# EAGLE design cube (EAGLE 9.5.2)
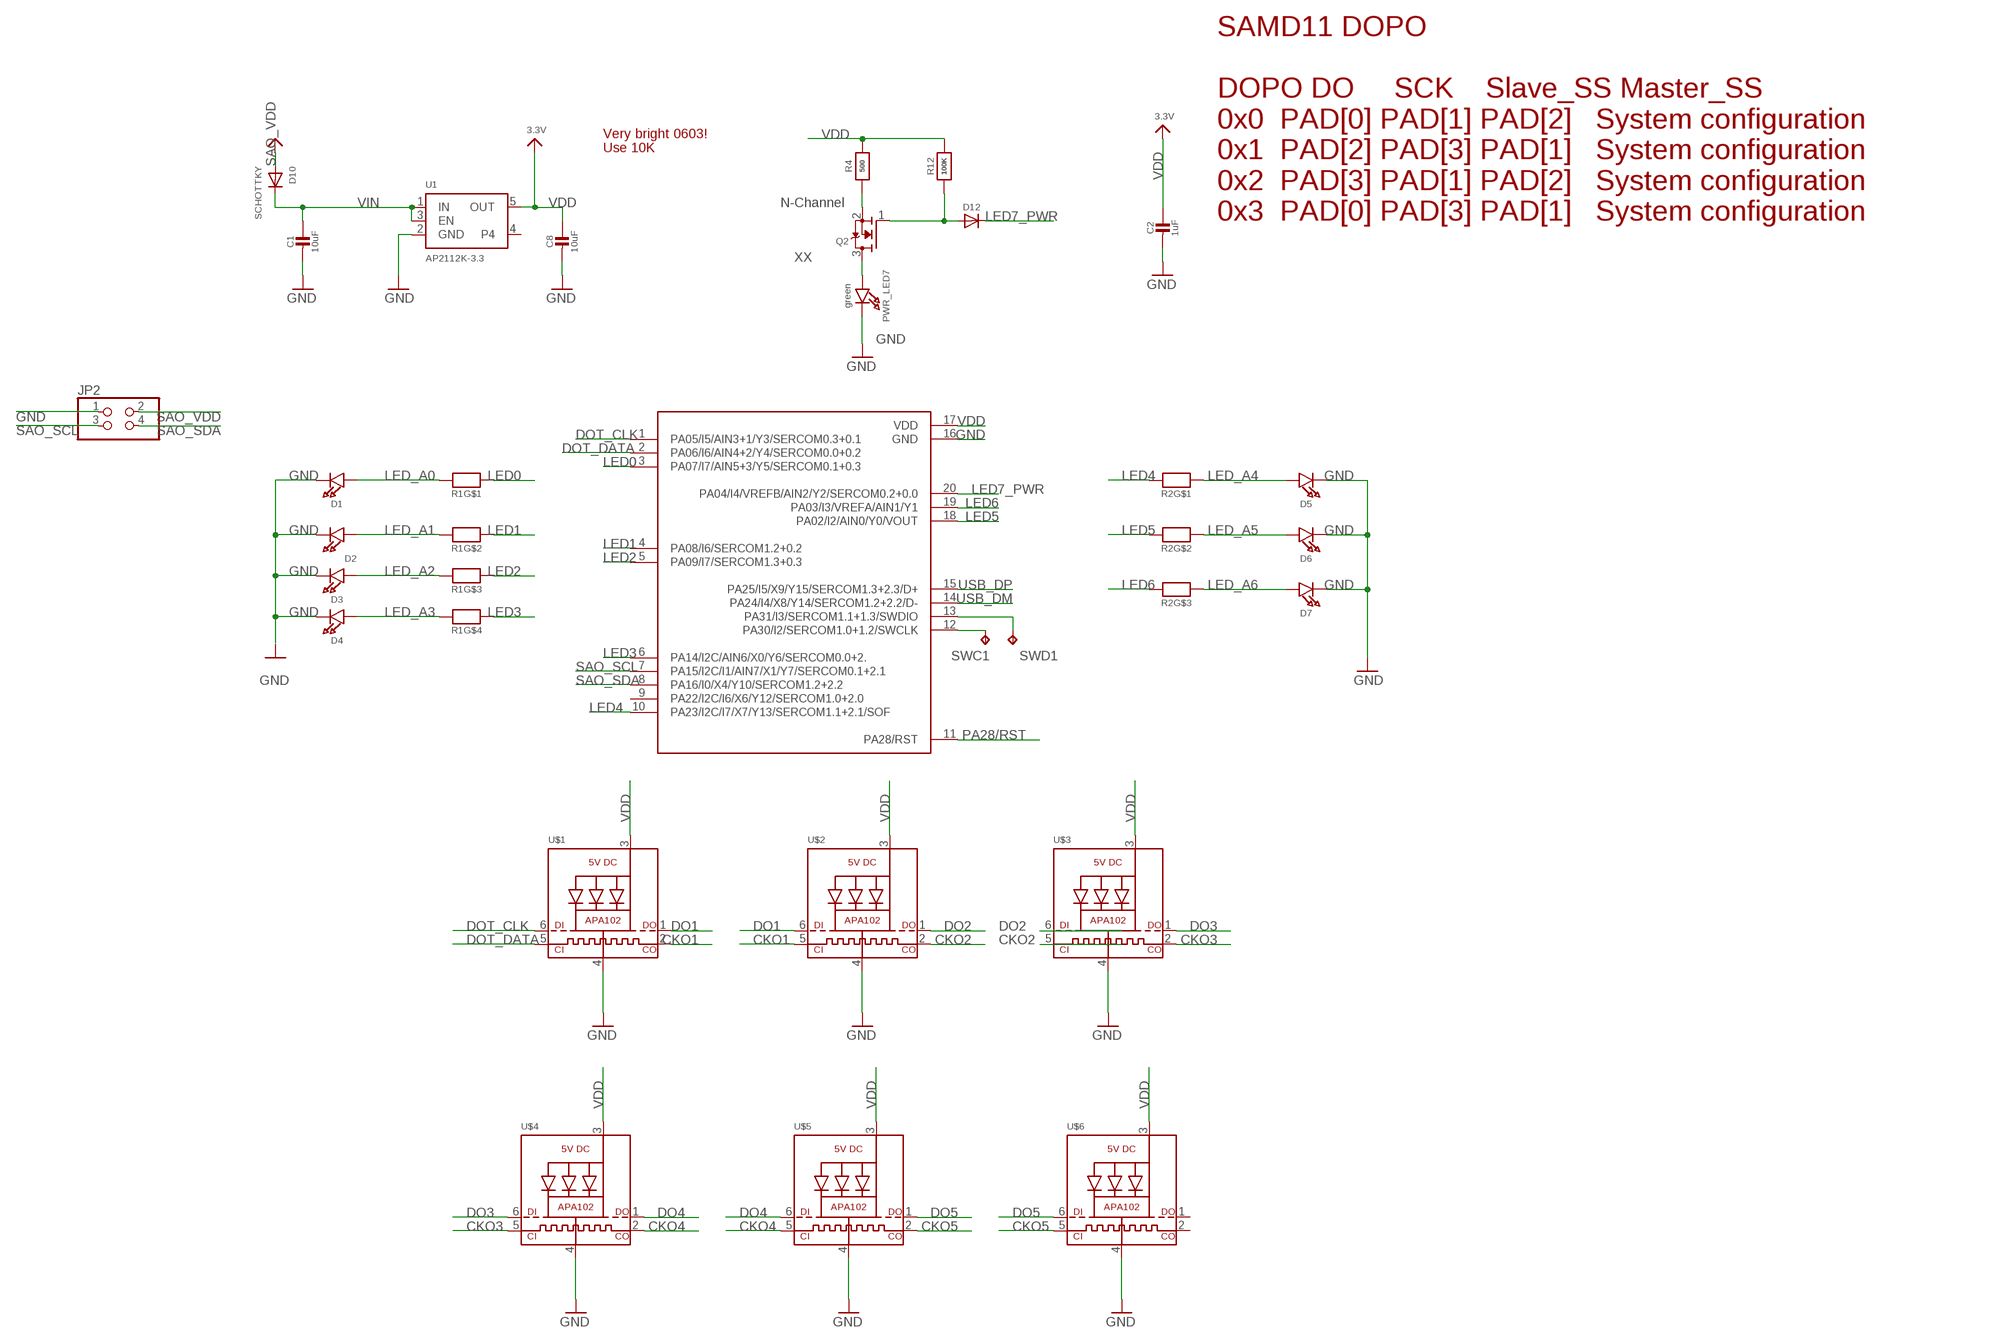
[diagram p0: schematic, sheet 1]

## Parts
C1  10uF  CAP_CERAMIC0805-NOOUTLINE  [0805-NO]
C2  1uF  CAP_CERAMIC0603_NO  [0603-NO]
C8  10uF  CAP_CERAMIC0805-NOOUTLINE  [0805-NO]
D1  LED0603_NOOUTLINE  [CHIPLED_0603_NOOUTLINE]
D2  LED0603_NOOUTLINE  [CHIPLED_0603_NOOUTLINE]
D3  LED0603_NOOUTLINE  [CHIPLED_0603_NOOUTLINE]
D4  LED0603_NOOUTLINE  [CHIPLED_0603_NOOUTLINE]
D5  LED0603_NOOUTLINE  [CHIPLED_0603_NOOUTLINE]
D6  LED0603_NOOUTLINE  [CHIPLED_0603_NOOUTLINE]
D7  LED0603_NOOUTLINE  [CHIPLED_0603_NOOUTLINE]
D10  SCHOTTKY  DIODE_SOD-123FL  [SOD-123FL]
D12  DIODESOD-323  [SOD-323]
JP2  PINHD-2X2  [2X02]
PWR_LED7  green  LED0603_NOOUTLINE  [CHIPLED_0603_NOOUTLINE]
Q2  MOSFET-NREFLOW  [SOT23-R]
R1  RESISTOR_4PACK_NO  [RESPACK_4X0603_NO]
R2  RESISTOR_4PACK_NO  [RESPACK_4X0603_NO]
R4  500  RESISTOR_0603_NOOUT  [0603-NO]
R12  100K  RESISTOR_0603_NOOUT  [0603-NO]
SWC1  TPB1,27  [B1,27]
SWD1  TPB1,27  [B1,27]
U1  AP2112K-3.3  VREG_SOT23-5  [SOT23-5]
U$1  APA1022020  [APA102_2020]
U$2  APA1022020  [APA102_2020]
U$3  APA1022020  [APA102_2020]
U$4  APA1022020  [APA102_2020]
U$5  APA1022020  [APA102_2020]
U$6  APA1022020  [APA102_2020]
U$7  SOIC20WIDE_ATSAMD11D14A-SS  [SOIC20WIDE_SOIC20WIDE]

## Nets
CKO1: U$1.2(CKO) U$2.5(CKI)
CKO2: U$2.2(CKO) U$3.5(CKI)
CKO3: U$3.2(CKO) U$4.5(CKI)
CKO4: U$4.2(CKO) U$5.5(CKI)
CKO5: U$5.2(CKO) U$6.5(CKI)
DO1: U$1.1(DO) U$2.6(DI)
DO2: U$2.1(DO) U$3.6(DI)
DO3: U$3.1(DO) U$4.6(DI)
DO4: U$4.1(DO) U$5.6(DI)
DO5: U$5.1(DO) U$6.6(DI)
DOT_CLK: U$1.6(DI) U$7.1(PA05/I5/AIN3+1/Y3/SERCOM0.3+0.1)
DOT_DATA: U$1.5(CKI) U$7.2(PA06/I6/AIN4+2/Y4/SERCOM0.0+0.2)
GND: C1.2 C2.2 C8.2 D1.C D2.C D3.C D4.C D5.C D6.C D7.C JP2.1 PWR_LED7.C U1.2(GND) U$1.4(GND) U$2.4(GND) U$3.4(GND) U$4.4(GND) U$5.4(GND) U$6.4(GND) U$7.16(GND)
LED0: R1.1 U$7.3(PA07/I7/AIN5+3/Y5/SERCOM0.1+0.3)
LED1: R1.2 U$7.4(PA08/I6/SERCOM1.2+0.2)
LED2: R1.3 U$7.5(PA09/I7/SERCOM1.3+0.3)
LED3: R1.4 U$7.6(PA14/I2C/AIN6/X0/Y6/SERCOM0.0+2.)
LED4: R2.1 U$7.10(PA23/I2C/I7/X7/Y13/SERCOM1.1+2.1/SOF)
LED5: R2.2 U$7.18(PA02/I2/AIN0/Y0/VOUT)
LED6: R2.3 U$7.19(PA03/I3/VREFA/AIN1/Y1)
LED7_PWR: D12.C U$7.20(PA04/I4/VREFB/AIN2/Y2/SERCOM0.2+0.0)
LED_A0: D1.A R1.8
LED_A1: D2.A R1.7
LED_A2: D3.A R1.6
LED_A3: D4.A R1.5
LED_A4: D5.A R2.8
LED_A5: D6.A R2.7
LED_A6: D7.A R2.6
N$5: SWC1.TP U$7.12(PA30/I2/SERCOM1.0+1.2/SWCLK)
N$6: D12.A Q2.1(G) R12.1
N$7: SWD1.TP U$7.13(PA31/I3/SERCOM1.1+1.3/SWDIO)
N$36 [power]: Q2.2(S) R4.1
PA28/RST: U$7.11(PA28/RST)
SAO_SCL: JP2.3 U$7.7(PA15/I2C/I1/AIN7/X1/Y7/SERCOM0.1+2.1)
SAO_SDA: JP2.4 U$7.8(PA16/I0/X4/Y10/SERCOM1.2+2.2)
SAO_VDD: D10.A JP2.2 ; supply symbol labelled VBAT
USB_DM: U$7.14(PA24/I4/X8/Y14/SERCOM1.2+2.2/D-)
USB_DP: U$7.15(PA25/I5/X9/Y15/SERCOM1.3+2.3/D+)
VDD: C2.1 C8.1 R4.2 R12.2 U1.5(OUT) U$1.3(VDD) U$2.3(VDD) U$3.3(VDD) U$4.3(VDD) U$5.3(VDD) U$6.3(VDD) U$7.17(VDD) ; supply symbol labelled 3.3V
VIN: C1.1 D10.C U1.1(IN) U1.3(EN)
XX: PWR_LED7.A Q2.3(D)
Unconnected: R2.4 R2.5 U1.4 U$6.1(DO) U$6.2(CKO) U$7.9(PA22/I2C/I6/X6/Y12/SERCOM1.0+2.0)

## Notes on the sheet
- Very bright 0603!
  Use 10K
- N-Channel
- SAMD11 DOPO
  
  DOPO DO     SCK    Slave_SS Master_SS
  0x0  PAD[0] PAD[1] PAD[2]   System configuration
  0x1  PAD[2] PAD[3] PAD[1]   System configuration
  0x2  PAD[3] PAD[1] PAD[2]   System configuration
  0x3  PAD[0] PAD[3] PAD[1]   System configuration

## Library data of the parts
C1 C2 C8 = microbuilder:CAP_CERAMIC: Ceramic Capacitors For new designs, use the packages preceded by an '_' character since they are more reliable: The following footprints should be used on most boards: _0402 - Standard footprint for regular board layouts _0603 - Standard footprint for regular board layouts _0805 - Standard footprint for regular board layouts _1206 - Standard footprint for regular board layouts For extremely tight-pitch boards where space is at a premium, the following 'micro-pitch' footprints can be used (smaller pads, no silkscreen outline, etc.): _0402MP - Micro-pitch footprint for very dense/compact boards _0603MP - Micro-pitch footprint for very dense/compact boards _0805MP - Micro-pitch footprint for very dense/compact boards _1206MP - Micro-pitch footprint for very dense/compact boards
D1-D7 PWR_LED7 = microbuilder:LED: LED 0603 - 0603 Surface Mount Package 2mA: Green LED - Low Power (3.9mcd, 2ma, 1.7Vf) - Digikey: 475-2709-2-ND Orange LED - Low Power (9.8mcd, 2ma, 1.8Vf) - Digikey: 475-1194-2-ND Red LED - Low Power (5mcd, 2ma, 1.8Vf) - Digikey: 475-1195-2-ND Yellow LED - Low Power (7mcd, 2ma, 1.8Vf) - Digikey: 475-1196-2-ND 5mA: Blue LED - Low Power (17mcd, 5ma, 2.9Vf) - Digikey: LNJ937W8CRACT-ND 0805 - 0805 Surface Mount Package 2mA: Red LED (8.8mcd, 2mA, 1.8Vf, Clear) - Low Power [Digikey: 475-2510-1-ND] Green LED (5mcd, 2mA, 1.8Vf, Clear) - Low Power [Digikey: 475-2730-1-ND] Yellow LED (11.3mcd, 2mA, 1.8Vf, Clear) - Low Power [Digikey: 475-2555-1-ND] 20mA: Red LED (104mcd, 20mA, Diffused) - LS R976 [Digikey: 475-1278-6-ND] Red LED (12mcd, 20mA, 2.0Vf, Clear) - APT2012EC [Digikey: 754-1128-1-ND] Green LED (15mcd, 20mA, 2.2Vf, Clear) - APT2012GC [Digikey: 754-1131-1-ND] Orange LED (160mcd, 20mA, 2.1Vf, Clear) - APT2012SECK [Digikey: 754-1130-1-ND] 1206 - 1206 Surface Mount Package Green LED (26mcd, 20mA, Diffused) - LG N971 [Digikey: 475-1407-6-ND] Red LED (15mcd, 20mA, Diffused) - LH N974 [Digikey: 475-1416-6-ND] Cree - Cree High-Power Surface Mount LEDs XPEBWT-L1-0000-00D50 - White 111lm 350mA 2.9Vf 6200K 110° XTEAWT-00-0000-00000LEE3 - White 114lm 350mA 2.85Vf 5000K 115° Everlight - Everlight 45-21 Series Surface Mount LEDs 45-21/QK2C-B2832AC2CB2/2T - Warm White 2000mcd 20mA 3.25Vf 3050K 120° 45-21/LK2C-B38452C4CB2/2T - Nuetral White 2000mcd 20mA 3.25Vf 4150K 120° 45-21/LK2C-B50634C6CB2/2T - Cold White 2200mcd 20mA 3.25Vf 5650K 120° PLCC2 Reverse Mount LS T77K-J1L2-1-0-2-R18-Z - Red 11.25mcd 2mA 1.8Vf 630nm 120° LO T77K-L1M2-24-Z - Orange 19.6mcd 2mA 1.8Vf 606nm 120° LY T77K-K2M1-26-Z - Yellow 15.7mcd 2mA 1.8Vf 587nm 120°
D10 = adafruit:DIODE: Diode
D12 = microbuilder:DIODE: Diode
JP2 = pinhead:PINHD-2X2: PIN HEADER
Q2 = microbuilder:MOSFET-N: N-Channel Mosfet LEGEND VDS: Voltage Drain-Source ID: Drain Current RDS(ON): Drain-Source On-State Resistance VGS(TH): Gate-Source Threshold Voltage CISS: Drain-Source Input Capacitance SOT-23 Name VDS ID RDS(ON) VGS(TH) CISS Order Number 2N7002E 60V 260mA 2.5 Ohm 2.5V @ 250uA 26.7pF @ 25V 2N7002ET1GOSTR-ND BSH103 30V 850mA 400 mOhm 400mV @ 1mA 83pF @ 24V BSH103,235-ND BSS138 60V 320mA 1.6 Ohm 1.5V @ 250uA 50pF @ 10V Mouser: 771-BSS138PW115 DMN2075U-7 20V 4.2A 38 mOhm 1V @ 250 uA 594.3pF @ 10V DMN2075U-7DICT-ND * BSS138 good choice for I2C level-shifting POWERPAK 1212-8 Name VDS ID RDS(ON) VGS(TH) CISS Order Number Si7308DN 60V 6A 58 mOhm 3V @ 250uA 665pF @ 15V SI7308DN-T1-E3CT-ND
R1 R2 = microbuilder:RESISTOR_4PACK: Resistor Packs (4 resistors) 4 x 0603 10K 1/16W - Digikey: YC164J-10KCT-ND
R4 R12 = microbuilder:RESISTOR: Resistors For new designs, use the packages preceded by an '_' character since they are more reliable: The following footprints should be used on most boards: _0402 - Standard footprint for regular board layouts _0603 - Standard footprint for regular board layouts _0805 - Standard footprint for regular board layouts _1206 - Standard footprint for regular board layouts For extremely tight-pitch boards where space is at a premium, the following 'micro-pitch' footprints can be used (smaller pads, no silkscreen outline, etc.): _0402MP - Micro-pitch footprint for very dense/compact boards _0603MP - Micro-pitch footprint for very dense/compact boards _0805MP - Micro-pitch footprint for very dense/compact boards _1206MP - Micro-pitch footprint for very dense/compact boards
SWC1 SWD1 = testpad:TP: Test pad
U1 = microbuilder:VREG_SOT23-5: SOT23-5 Fixed Voltage Regulators Part Current Out V Out V In V Dropout θJA (°C/W) TJ (°C) Digikey Part No. ADP121 150mA 3.3V 3.4-5.5V 0.09V @ 150mA -- -- ADP121-AUJZ33R7CT-ND ADP121 150mA 3.0V 3.1-5.5V 0.09V @ 150mA -- -- ADP121-AUJZ30R7CT-ND ADP122 300mA 3.3V 3.4-5.5V 0.085V @ 300mA -- -- ADP122AUJZ-3.3-R7CT-ND ADP1712 300mA 3.3V 3.5-5.5V 0.17V @ 300mA -- -- ADP1712AUJZ-3.3-R7TR-ND AP7311 (Low Cost) 150mA 3.3V 3.5-6V 0.15V @ 150mA -- -- AP7311-33WG-7DICT-ND LD39015M18R 150mA 1.8V 1.9V-5.5V 0.08V @ 100mA -- -- 497-6977-1-ND LP2985A-33DBVR 150mA 3.3V 3.3-16V 0.28V @ 150mA 206 150 296-18479-1-ND MCP1824T-3302E/OT 300mA 3.3V 3.5V-6V 0.2V @ 300mA -- -- MCP1824T-3302E/OTCT-ND MIC5205-2.5YM5 TR 150mA 2.5V 2.7-16V 0.165V @ 150mA -- -- 576-1257-2-ND MIC5205-3.0YM5 TR 150mA 3.0V 3.2V-16V 0.165V @ 150mA -- -- 576-1258-2-ND MIC5205-3.3YM5 TR 150mA 3.3V 3.5V-16V 0.165V @ 150mA -- -- 576-1259-2-ND TPS780330220 150mA 3.3V+2.2V 3.6-5.5V 250mV Max -- -- 296-23332-1-ND TDA3663/N1,135 100mA 3.3V 3.5-45V 0.18V @ 50mA -- -- 568-5343-1-ND Max operating temp can be calculated using θJA, TJ (max junction temperature), and power in watts. Set the "Maximum Ambient Temperature" until it reaches TJ ("Max Junction Temperature"), which is the absolute limit for safe use of the regulator: Heat Sink Temperature Calculator <http://www.daycounter.com/Calculators/Heat-Sink-Temperature-Calculator.phtml> For example, With 12V source into a 3.3V LP2985 and a 30mA load, we are dissipating (12V-3.3V) * 0.03A = 0.261W. With a θJA of 206 °C/W, a TJ of 150°C, and 261mW we can safely use the chip without a heat sink up to 75°C (=147.1°C Junction Temperature).
U$1-U$6 = microbuilder:APA102: APA102/DotStar Pixels VCC: 5V DC Refresh Rate: 400Hz
U$7 = cube:SOIC20WIDE_ATSAMD11D14A-SS

## Net classes
1 power: width 0.305 mm
2 gnd: width 0.254 mm

## Board
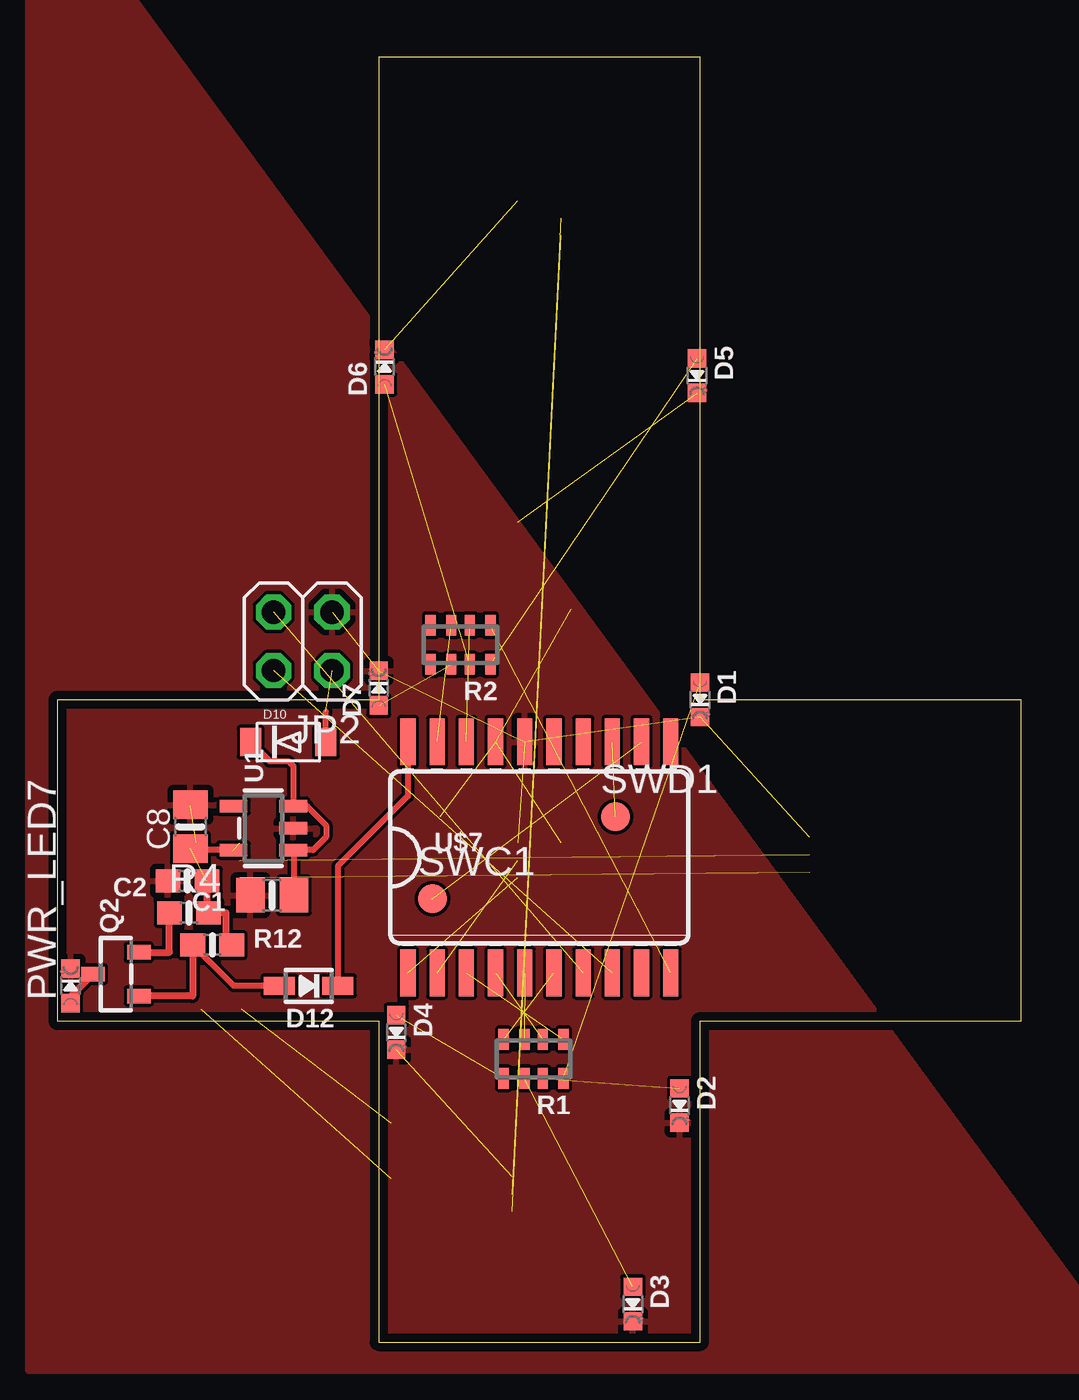
[diagram p1: board, top side]
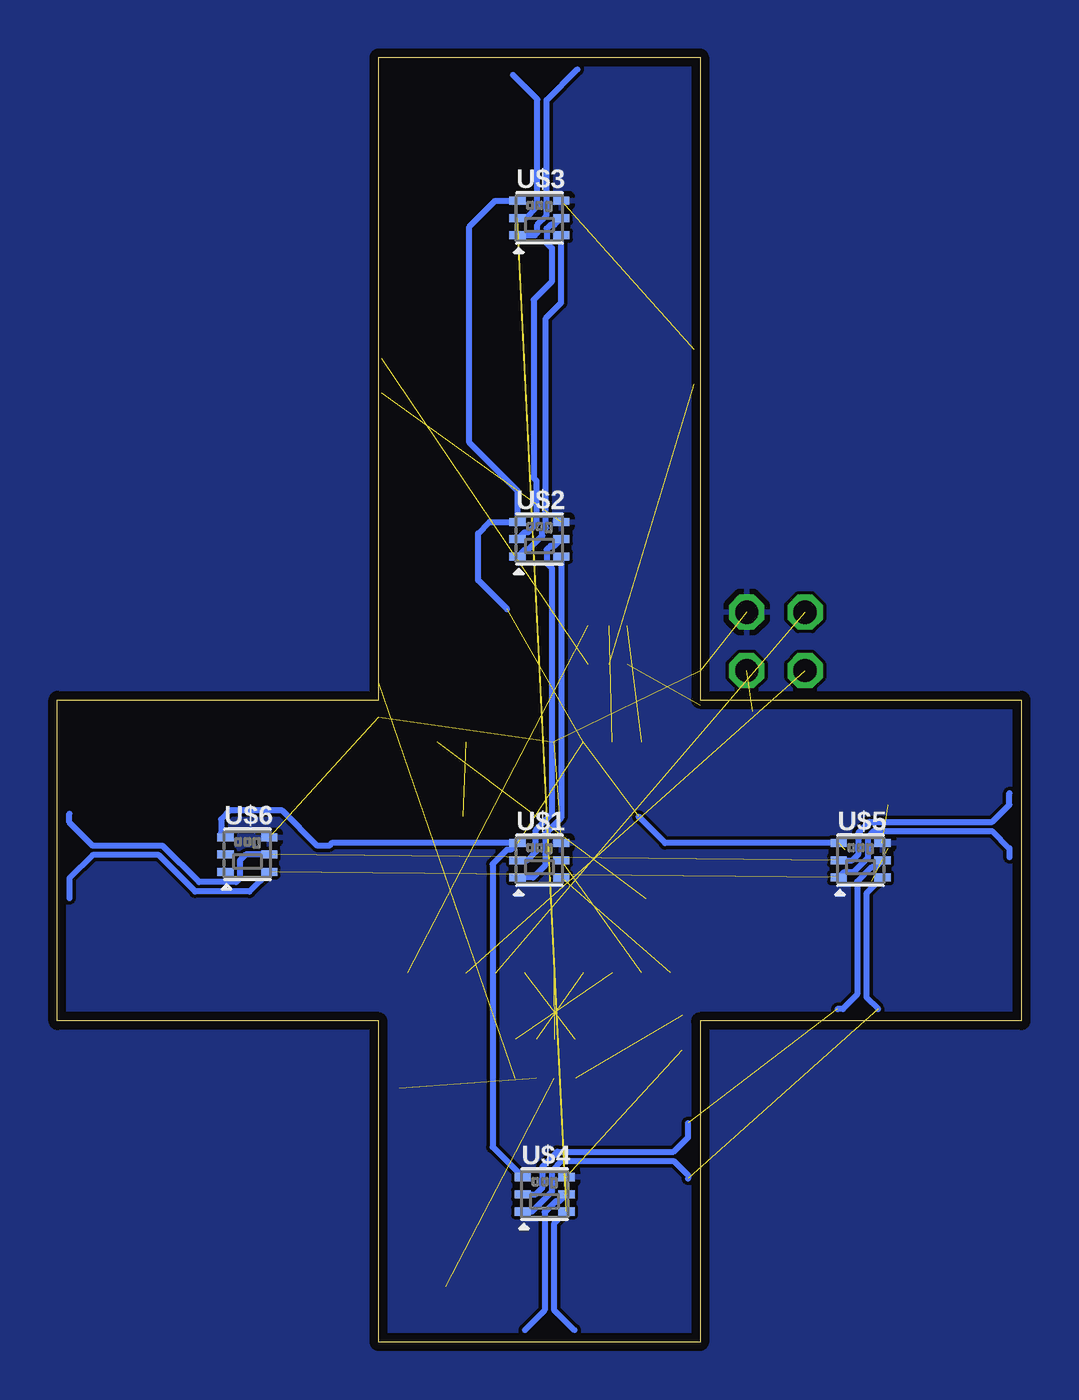
[diagram p2: board, bottom side, seen from below]

Size 41.91 x 55.88 mm. Coordinates in mm from the lower left corner, seen from the top.
Outline: 13.97,13.97 13.97,0 27.94,0 27.94,13.97 41.91,13.97 41.91,27.94 27.94,27.94 27.94,55.88 13.97,55.88 13.97,27.94 0,27.94 0,13.97 13.97,13.97
Copper layers (1*16): Top 0.035559375mm / dielectric 1.6mm / Bottom 0.035559375mm
Design rules "oshpark-2layer-tented": minimum track width 6mil, minimum drill 10mil, track to track 6mil, track to pad 6mil, pad to pad 6mil, via to via 6mil, smd to smd 6mil, copper to edge 15mil, drill to drill 6mil, minimum pad ring 5mil, minimum via ring 5mil, stop-mask expansion 2.5mil, vias tented up to drill 20mil, thermal gap 10mil

### Footprints (pad centres in the part's own frame; a part is rotated, then mirrored left to right if it is on the bottom)
0805-NO = smd 1.24 x 1.5: 1 -0.95,0; 2 0.95,0
0603-NO = smd 1.075 x 1: 1 -0.85,0; 2 0.85,0
CHIPLED_0603_NOOUTLINE = smd 0.8 x 0.8: A 0,-0.75; C 0,0.75
SOD-123FL = smd 0.91 x 1.22: A 1.637,0; C -1.637,0
SOD-323 = smd 1.35 x 0.8: A 1.27,0; C -1.27,0
2X02 = drill 1.016 octagon: 1 -1.27,-1.27; 2 -1.27,1.27; 3 1.27,-1.27; 4 1.27,1.27
SOT23-R = smd 0.635 x 1.016: 1 -0.95,-1; 2 0.95,-1; 3 0,1
RESPACK_4X0603_NO = smd 0.45 x 0.9: 1 -1.3,-0.85; 2 -0.4,-0.85; 3 0.4,-0.85; 4 1.3,-0.85; 5 1.3,0.85; 6 0.4,0.85; 7 -0.4,0.85; 8 -1.3,0.85
B1,27 = smd 1.27 x 1.27: TP 0,0
SOT23-5 = smd 0.55 x 1.2: 1 -0.95,-1.3; 2 0,-1.3; 3 0.95,-1.3; 4 0.95,1.3; 5 -0.95,1.3
APA102_2020 = smd 0.7 x 0.35: 1 -0.95,-0.75; 2 -0.95,0; 3 -0.95,0.75; 4 0.95,0.75; 5 0.95,0; 6 0.95,-0.75
SOIC20WIDE_SOIC20WIDE = smd 0.66 x 2.032: 1 -5.715,-5.029; 2 -4.445,-5.029; 3 -3.175,-5.029; 4 -1.905,-5.029; 5 -0.635,-5.029; 6 0.635,-5.029; 7 1.905,-5.029; 8 3.175,-5.029; 9 4.445,-5.029; 10 5.715,-5.029; 11 5.715,5.029; 12 4.445,5.029; 13 3.175,5.029; 14 1.905,5.029; 15 0.635,5.029; 16 -0.635,5.029; 17 -1.905,5.029; 18 -3.175,5.029; 19 -4.445,5.029; 20 -5.715,5.029

### Placement (x,y rotation side)
C1  9.33,19.43 180 top
C2  5.65,20.07 180 top
C8  5.78,22.42 90 top
D1  27.94,27.94 180 top
D2  27.05,10.29 180 top
D3  25.02,1.65 180 top
D4  14.73,13.46 180 top
D5  27.81,42.04 180 top
D6  14.22,42.42 0 top
D7  13.97,28.45 0 top
D10  10.03,26.1 0 top
D12  10.92,15.49 180 top
JP2  10.67,30.48 180 top
PWR_LED7  0.57,15.49 0 top
Q2  2.54,16 90 top
R1  20.7,12.32 180 top
R2  17.53,30.33 180 top
R4  5.71,18.67 0 top
R12  6.73,17.27 0 top
SWC1  16.31,19.28 0 top
SWD1  24.26,22.86 0 top
U1  8.95,22.35 90 top
U$1  20.96,20.96 0 bottom
U$2  20.96,34.92 0 bottom
U$3  20.96,48.89 0 bottom
U$4  20.73,6.43 0 bottom
U$5  6.99,20.96 0 bottom
U$6  33.66,21.21 0 bottom
U$7  20.96,21.08 0 top

### Tracks (layer width: path | path; a pad name or v marks a point on that pad's centre or on a via)
CKO1
  Bottom 0.254: U$1.2 21.49,20.96 21.11,21.34 21.11,22.27 20.41,22.97 20.41,33.66 20.63,33.88 20.63,34.47 20.47,34.63 20.3,34.63 U$2.5
CKO2
  Bottom 0.254: U$2.2 21.61,35.22 21.44,35.22 21.08,35.58 21.08,37.47 21.21,37.59 21.21,45.34 20.41,46.14 20.41,47.59 20.63,47.81 20.63,48.44 20.47,48.6 20.3,48.6 U$3.5
CKO3  (1 unrouted)
  Bottom 0.254: U$3.2 21.55,48.89 21.04,49.4 21.04,54.06 22.1,55.12 | U$4.5 20.07,6.13 20.24,6.13 20.73,5.65 20.73,1.38 21.59,0.52
CKO4  (1 unrouted)
  Bottom 0.254: U$4.2 21.12,6.43 20.81,6.73 20.81,7.64 20.17,8.28 15.11,8.28 14.49,8.9 14.49,9.53 | U$5.5 6.33,20.66 6.5,20.66 7.14,20.02 7.14,15.11 7.76,14.49 8,14.49
CKO5  (1 unrouted)
  Bottom 0.254: U$5.2 7.36,20.96 7.07,21.24 7.07,22.16 6.6,22.63 1.26,22.63 0.52,23.37 0.52,23.88 | U$6.5 33.72,21.21 33.98,20.96 33.98,20.17 34.14,20.01 35.75,20.01 37.34,21.59 40.37,21.59 41.39,22.61 41.39,22.99
DO1
  Bottom 0.254: U$2.6 20.01,22.8 20.7,22.1 20.7,20.73 21.23,20.21 U$1.1
DO2
  Bottom 0.254: U$2.1 21.61,34.47 21.44,34.47 20.83,35.08 20.83,35.26 20.68,35.41 20.68,44.54 20.01,45.21 U$3.6
DO3  (1 unrouted)
  Bottom 0.254: U$3.1 21.16,48.14 21.04,48.26 21.04,48.6 20.64,49.01 20.63,49.01 20.63,54.03 19.3,55.36 | U$4.6 20.32,5.13 20.32,1.41 19.43,0.52
DO4  (1 unrouted)
  Bottom 0.254: U$4.1 21.27,5.68 20.41,6.54 20.41,7.47 20,7.87 15.11,7.87 14.49,7.25 14.49,7.11 | U$5.6 6.73,19.51 6.73,15 6.22,14.49
DO5  (1 unrouted)
  Bottom 0.254: U$5.1 7.69,20.45 7.29,20.45 6.66,21.07 6.66,22 6.44,22.23 1.27,22.23 0.52,21.48 0.52,21.08 | U$6.6 33.57,19.6 35.92,19.6 37.51,21.18 40.39,21.18 41.39,20.18 41.39,19.3
DOT_CLK  (1 unrouted)
DOT_DATA  (1 unrouted)
GND  (9 unrouted)
  pour Top: -1.27,64.77 46.99,-1.27 -1.27,-1.27
  pour Bottom: -3.81,67.31 49.53,67.31 49.53,-3.81 -3.81,-3.81
LED0  (1 unrouted)
LED1  (1 unrouted)
LED2  (1 unrouted)
LED3  (1 unrouted)
LED4  (1 unrouted)
LED5  (1 unrouted)
LED6  (1 unrouted)
LED7_PWR
  Top 0.254: U$7.20 15.24,23.75 12.19,20.7 D12.C
LED_A0  (1 unrouted)
LED_A1  (1 unrouted)
LED_A2  (1 unrouted)
LED_A3  (1 unrouted)
LED_A4  (1 unrouted)
LED_A5  (1 unrouted)
LED_A6  (1 unrouted)
N$5  (1 unrouted)
N$6
  Top 0.254: D12.A 7.66,15.49 R12.1
  Top 0.305: R12.1 5.88,15.05 Q2.1
N$7  (1 unrouted)
N$36
  Top 0.305: Q2.2 4.87,16.95 R4.1
SAO_SCL  (1 unrouted)
SAO_SDA  (1 unrouted)
SAO_VDD  (1 unrouted)
  Top 0.254: D10.A 11.67,27.42
VDD  (5 unrouted)
  Top 0.254: U1.5 5.84,21.4 C8.1
  Top 0.305: R12.2 7.33,17.53 7.33,18.67 R4.2 6.5,18.73 C2.1
  Bottom 0.254: U$5.3 15.48,21.71 16.64,22.86 | U$6.3 34.8,22.15 34.8,22.73 34.42,23.11 32.13,23.11 30.61,21.59 30.1,21.59 29.98,21.71 U$1.3 22.2,21.41 22.37,21.41 22.99,20.79 22.99,8.49 U$4.3 | 22.35,31.88 23.62,33.15 23.62,35.18 23.13,35.67 U$2.3 21.91,37.02 24,39.12 24,48.51 22.87,49.64 U$3.3
VIN
  Top 0.254: D10.C 9.22,25.27 10.03,25.27 10.25,25.05 U1.3 10.86,23.3 11.68,22.48 11.68,21.97 11.12,21.4 U1.1 10.27,21.39 10.28,21.46 C1.1
XX
  Top 0.305: Q2.3 0.57,15.03 PWR_LED7.A